# Altium schematic sheet Micromouse_Version2.SchDoc
size A3
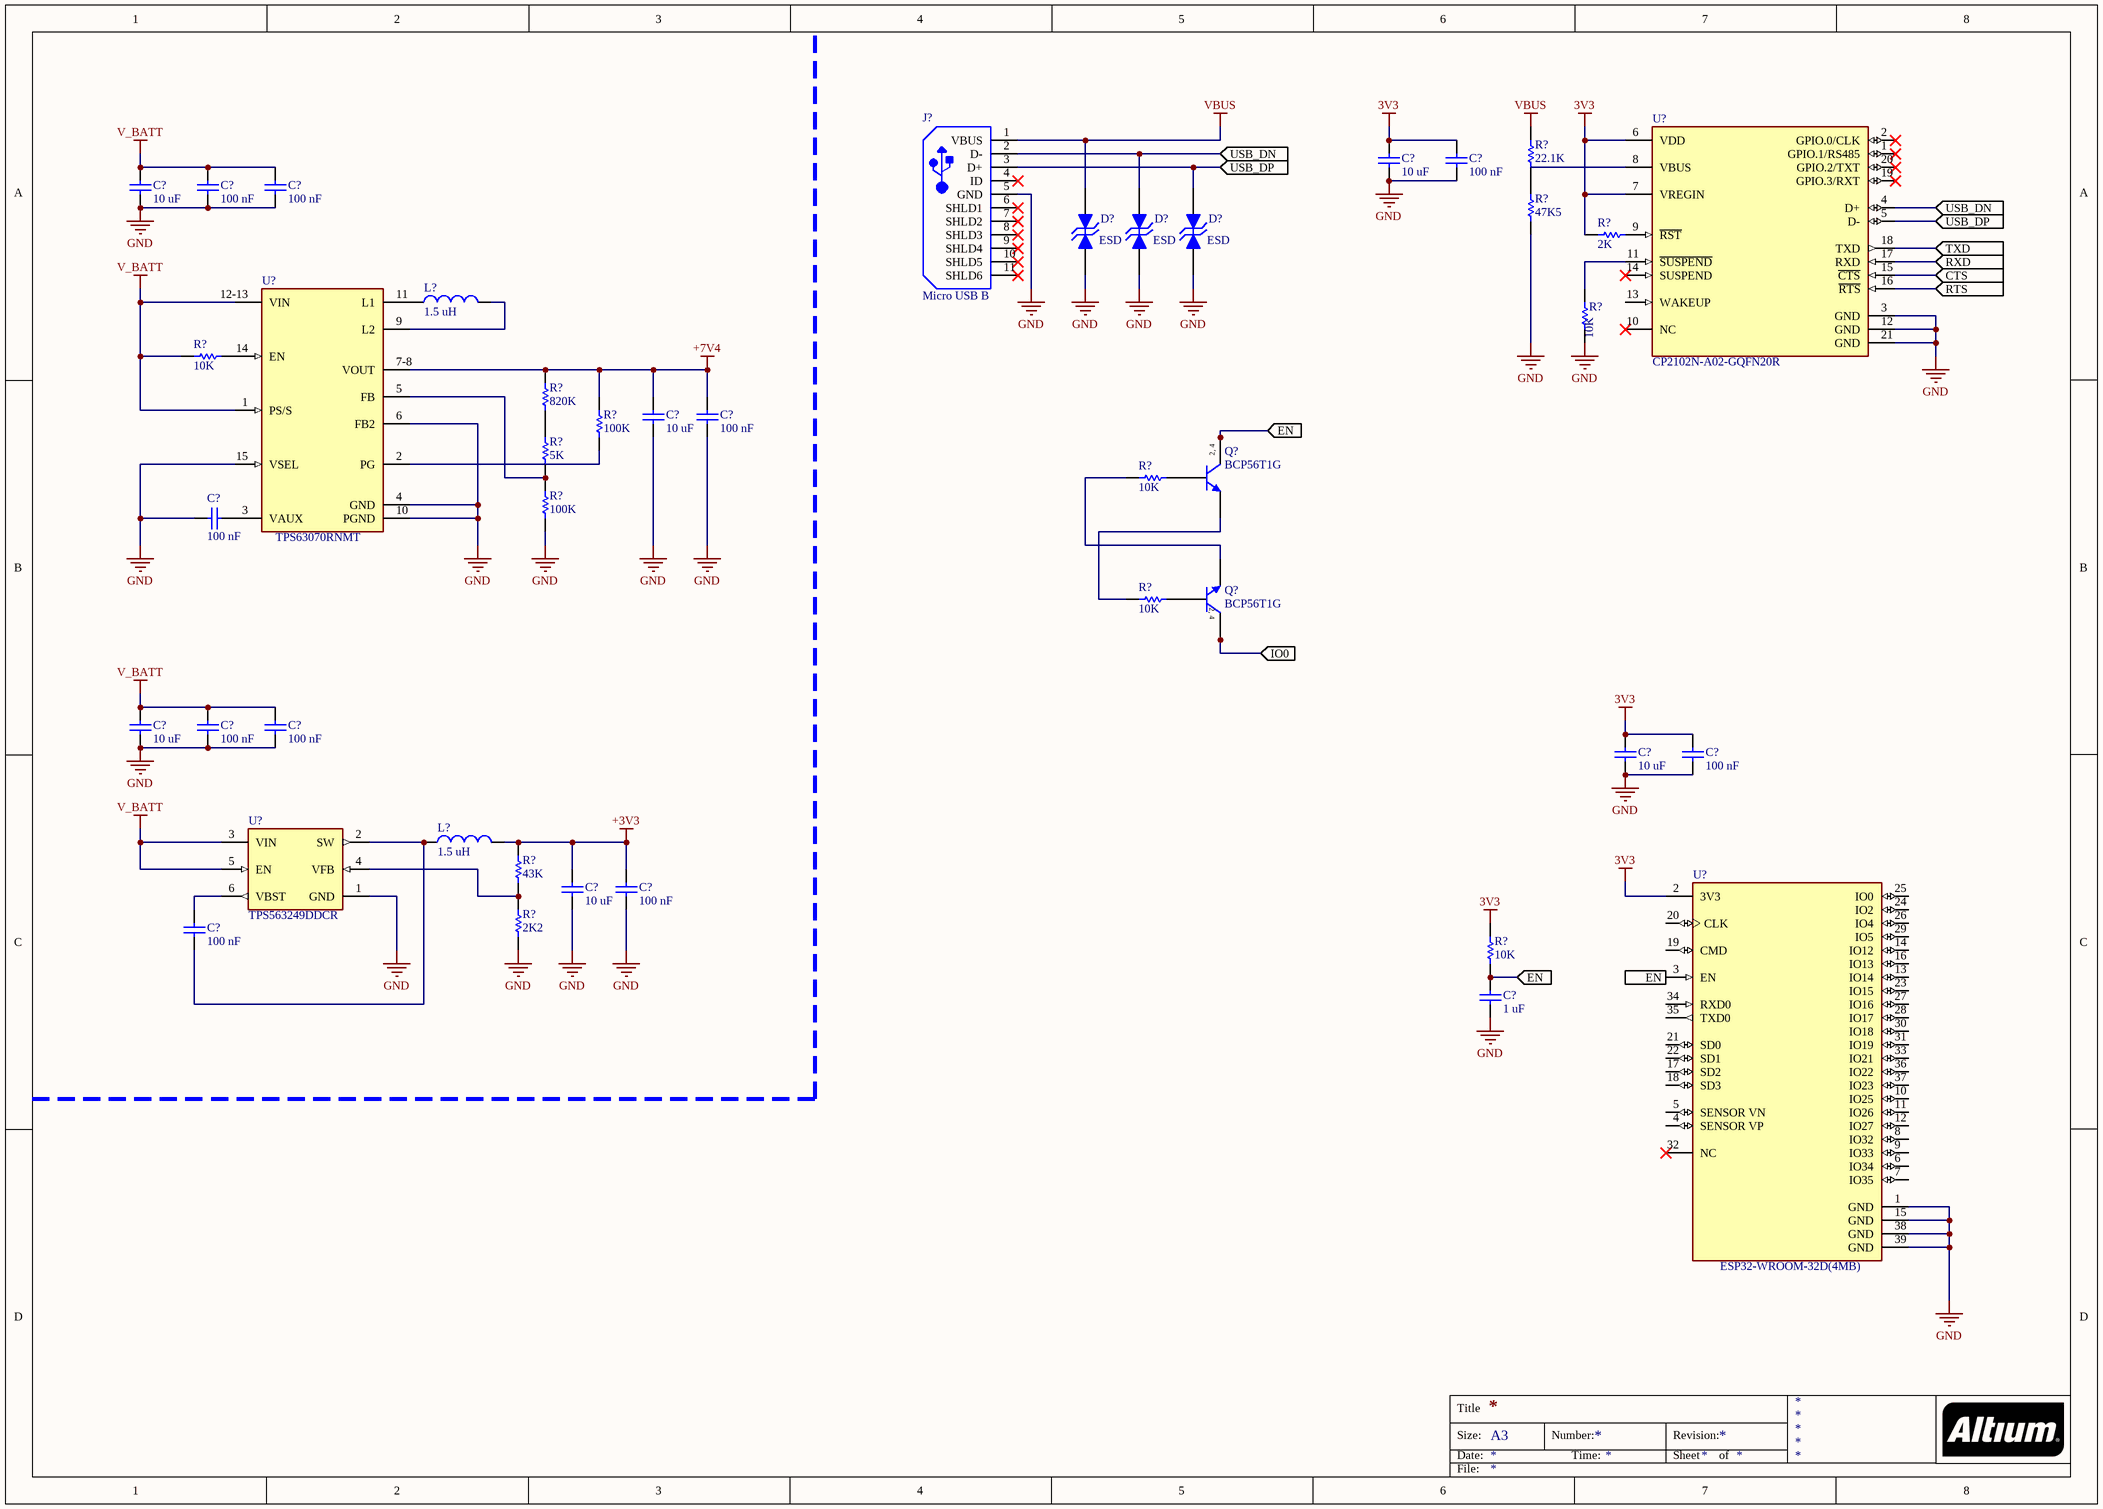
[diagram p0: Micromouse_Version2.SchDoc]

## Parts
(Parts that share a designator on the sheet are numbered #1, #2 ... from top to bottom, then left to right.)
C?#1  10 uF  [CAPC3216X180X50LL20T25]
C?#2  100 nF  [CAPC3216X180X55LL20T25]
C?#3  10 uF  [CAPC3216X180X50LL20T25]
C?#4  100 nF  [CAPC3216X180X55LL20T25]
C?#5  100 nF  [CAPC3216X180X55LL20T25]
C?#6  10 uF  [CAPC3216X180X50LL20T25]
C?#7  100 nF  [CAPC3216X180X55LL20T25]
C?#8  100 nF  [CAPC3216X180X55LL20T25]
C?#9  10 uF  [CAPC3216X180X50LL20T25]
C?#10  100 nF  [CAPC3216X180X55LL20T25]
C?#11  100 nF  [CAPC3216X180X55LL20T25]
C?#12  10 uF  [CAPC3216X180X50LL20T25]
C?#13  100 nF  [CAPC3216X180X55LL20T25]
C?#14  10 uF  [CAPC3216X180X50LL20T25]
C?#15  100 nF  [CAPC3216X180X55LL20T25]
C?#16  100 nF  [CAPC3216X180X55LL20T25]
C?#17  1 uF  [CAPC3216X180X50ML20T25]
D?#1  ESD  [ONSC-SOD-923-2-514AB-01_V]
D?#2  ESD  [ONSC-SOD-923-2-514AB-01_V]
D?#3  ESD  [ONSC-SOD-923-2-514AB-01_V]
J?  Micro USB B  [FCI-10118192-0001LF-5_V]
L?#1  1.5 uH  [VISH-IHLP2525CZER1R5M01_V]
L?#2  1.5 uH  [VISH-IHLP2525CZER1R5M01_V]
Q?#1  BCP56T1G  [ONSC-SOT-223-4-318E-04_V]
Q?#2  BCP56T1G  [ONSC-SOT-223-4-318E-04_V]
R?#1  22.1K  [RESC3216X70X50NL05T20]
R?#2  47K5  [RESC1206(3216)_L]
R?#3  2K  [RESC3216X70X50ML20T25]
R?#4  10K  [RESC3216X60X45ML10T20]
R?#5  10K  [RESC3216X60X45ML10T20]
R?#6  820K  [RESC3216X70X50LL20T25]
R?#7  100K  [RESC3216X60X45NL10T20]
R?#8  5K  [RESC3216X84X51LL20T13]
R?#9  10K  [RESC3216X60X45ML10T20]
R?#10  100K  [RESC3216X60X45NL10T20]
R?#11  10K  [RESC3216X60X45ML10T20]
R?#12  43K  [RESC3216X70X50NL05T20]
R?#13  2K2  [RESC3216X60X45NL10T20]
R?#14  10K  [RESC3216X60X45ML10T20]
U?#1  CP2102N-A02-GQFN20R  [FP-CP2102N-A02-GQFN20R-MFG]
U?#2  TPS63070RNMT  [FP-RNM0015A-MFG]
U?#3  TPS563249DDCR  [FP-DDC0005A-MFG]
U?#4  ESP32-WROOM-32D(4MB)  [FP-ESP32-WROOM-32D_4MB-MFG]

## Ports
CTS (in), EN (in), IO0 (in), RTS (in), RXD (in), TXD (in), USB_DN (in), USB_DP (in)

## Nets
3V3: C?#1.2 C?#2.2 C?#12.2 C?#13.2 R?#3.1 R?#14.2 U?#1.6(VDD) U?#1.7(VREGIN) U?#4.2(3V3)
+3V3: C?#14.2 C?#15.2 L?#2.2 R?#12.2
+7V4: C?#6.2 C?#7.2 R?#6.2 R?#7.2 U?#2.7-8(VOUT)
GND: C?#1.1 C?#2.1 C?#3.1 C?#4.1 C?#5.1 C?#6.1 C?#7.1 C?#8.1 C?#9.1 C?#10.1 C?#11.1 C?#12.1 C?#13.1 C?#14.1 C?#15.1 C?#17.1 D?#1.1(A1) D?#2.1(A1) D?#3.1(A1) J?.5(GND) R?#2.1 R?#4.1 R?#10.1 R?#13.1 U?#1.3(GND) U?#1.12(GND) U?#1.21(GND) U?#2.4(GND) U?#2.6(FB2) U?#2.10(PGND) U?#2.15(VSEL) U?#3.1(GND) U?#4.1(GND) U?#4.15(GND) U?#4.38(GND) U?#4.39(GND)
V_BATT: C?#3.2 C?#4.2 C?#5.2 C?#9.2 C?#10.2 C?#11.2 R?#5.1 U?#2.1(PS/S) U?#2.12-13(VIN) U?#3.3(VIN) U?#3.5(EN)
VBUS: D?#1.2(A2) J?.1(VBUS) R?#1.2
CTS: U?#1.15(~{CTS}) ; port CTS
EN: C?#17.2 Q?#1.2(C) Q?#1.4(C) R?#14.1 U?#4.3(EN) ; port EN
IO0: Q?#2.2(C) Q?#2.4(C) ; port IO0
RTS: U?#1.16(~{RTS}) ; port RTS
RXD: U?#1.17(RXD) ; port RXD
TXD: U?#1.18(TXD) ; port TXD
USB_DN: D?#2.2(A2) J?.2(D-) U?#1.4(D+) ; port USB_DN
USB_DP: D?#3.2(A2) J?.3(D+) U?#1.5(D-) ; port USB_DP
NetC?#8_2: C?#8.2 U?#2.3(VAUX)
NetC?#16_1: C?#16.1 L?#2.1 U?#3.2(SW)
NetC?#16_2: C?#16.2 U?#3.6(VBST)
NetL?#1_1: L?#1.1 U?#2.11(L1)
NetL?#1_2: L?#1.2 U?#2.9(L2)
NetQ?#1_1: Q?#1.1(B) R?#9.1
NetQ?#1_3: Q?#1.3(E) R?#11.2
NetQ?#2_1: Q?#2.1(B) R?#11.1
NetQ?#2_3: Q?#2.3(E) R?#9.2
NetR?#1_1: R?#1.1 R?#2.2
NetR?#4_2: R?#4.2 U?#1.11(~{SUSPEND})
NetR?#5_2: R?#5.2 U?#2.14(EN)
NetR?#6_1: R?#6.1 R?#8.2
NetR?#7_1: R?#7.1 U?#2.2(PG)
NetR?#8_1: R?#8.1 R?#10.2 U?#2.5(FB)
NetR?#12_1: R?#12.1 R?#13.2 U?#3.4(VFB)

Not connected (* = marked no-connect by the designer): J? 4(ID)* 6(SHLD1)* 7(SHLD2)* 8(SHLD3)* 9(SHLD4)* 10(SHLD5)* 11(SHLD6)*; R?#3 2; U?#1 1(GPIO.1/RS485)* 2(GPIO.0/CLK)* 8(VBUS) 9(~{RST}) 10(NC)* 13(WAKEUP) 14(SUSPEND)* 19(GPIO.3/RXT)* 20(GPIO.2/TXT)*; U?#4 4(SENSOR_VP) 5(SENSOR_VN) 6(IO34) 7(IO35) 8(IO32) 9(IO33) 10(IO25) 11(IO26) 12(IO27) 13(IO14) 14(IO12) 16(IO13) 17(SD2) 18(SD3) 19(CMD) 20(CLK) 21(SD0) 22(SD1) 23(IO15) 24(IO2) 25(IO0) 26(IO4) 27(IO16) 28(IO17) 29(IO5) 30(IO18) 31(IO19) 32(NC)* 33(IO21) 34(RXD0) 35(TXD0) 36(IO22) 37(IO23)

## Notes on the sheet
- Title
- Size:
- Date:
- A3
- Number:
- Time:
- Revision:
- Sheet
- of
- File:
- (in symbol CMP-1048-00523-1) 2, 4

## Library data of the parts
C?#1 C?#3 C?#6 C?#9 C?#12 C?#14 = CMP-2000-06013-1: Chip Capacitor, 10 uF, +/- 10%, 10 V, -55 to 125 degC, 1206 (3216 Metric), RoHS, Tape and Reel; Type: SMDMLCCX7R6.3-250VDCCommericalGrade; Class: Class1; Case Height: 1.6mm; Temperature Coefficient / Code: +/-15%; Capacitance: 10uF; Brand: Kemet; Case Length: 3.2mm; Dissipation Factor DF: 5; Voltage Rating: 10V; Dielectric: X7R; Tolerance: 10%; Package Reference: 1206; Dimensions: 1.6mmWx3.2mmLx1.6mmH; Series: C1206C; Minimum Operating Temperature: -55C; RoHS: Details; Termination Style: SMD/SMT; Mounting Technology: SurfaceMount; Manufacturer: Kemet; Product Category: MultilayerCeramicCapacitorsMLCC-SMD/SMT; Case Code - mm: 3216; Manufacturer URL: http://www.kemet.com/; Product: GeneralTypeMLCCs; Package Description: 2-Pin Surface Mount Device, Body 3.2 x 1.6 mm; Case Width: 1.6mm; Factory Pack Quantity: 2000; Package / Case: 1206(3216metric); Datasheet URL: http://www.kemet.com/docfinder?Partnumber=C1206C106K8RACTU; Datasheet Version: 02/2016; Operating Temperature Range: -55Cto+125C; Voltage Rating DC: 10V; Case Code - in: 1206; Maximum Operating Temperature: +125C; Packaging: Reel
C?#2 C?#4 C?#5 C?#7 C?#8 C?#10 C?#11 C?#13 C?#15 C?#16 = CMP-2000-06343-1: Chip Capacitor, 100 nF, +/- 5%, 25 V, -55 to 125 degC, 1206 (3216 Metric), RoHS, Tape and Reel; Manufacturer: Murata; External Width: 0.5mm; Voltage Rating V DC: 25V; Capacitor Case Style: 1206[3216Metric]; Insulation Resistance: 10000Mohm; Capacitor Terminals: SMD; Capacitance: 0.1µF; Temperature Coefficient: 0ppm/°C±30ppm/°C; External Length / Height: 1mm; Reel Quantity: 2000; Dielectric Characteristic: C0G/NP0; SVHC: NoSVHC(19-Dec-2012); No. of Pins: 2; Manufacturer URL: http://www.murata.com/; Mounting Technology: SurfaceMount; Operating Temperature Range: -55°Cto+125°C; Operating Temperature Max: 125°C; Package Description: 2-Pin Surface Mount Device, Body 3.2 x 1.6 mm; Operating Temperature Min: -55°C; Terminal Type: SurfaceMount(SMD,SMT); MSL: –; Tolerance +: 5%; Voltage Rating: 25V; Datasheet URL: https://datasheet.ciiva.com/3777/11308grm31c5c1e104ja0123-3777177.pdf; Datasheet Version: 09/2014; Package / Case: 1206; Capacitance Tolerance: ±5%; Package Reference: 1206; Lead Spacing: –; Tolerance -: 5%
C?#17 = CMP-2000-04991-1: Chip Capacitor, 1 uF, +/- 10%, 25 V, -55 to 125 degC, 1206 (3216 Metric), RoHS, Tape and Reel; Manufacturer: Kemet; Temperature Coefficient / Code: +/-15%; Capacitance: 1uF; Dielectric: X7R; Voltage Rating DC: 25V; Capacitance - nF: 1000nF; Class: Class1; Case Length: 3.2mm; Type: SMDMLCCX7R6.3-250VDCCommericalGrade; Case Width: 1.6mm; Product: GeneralTypeMLCCs; Datasheet URL: https://ciiva.com/datasheet-click-18194173?src=ciiva&sig=6daff8c4; Operating Temperature Range: -55Cto+125C; Series: C1206C; RoHS: Details; Product Category: MultilayerCeramicCapacitorsMLCC-SMD/SMT; Manufacturer URL: http://www.kemet.com/; Minimum Operating Temperature: -55C; Dimensions: 1.6mmWx3.2mmLx1.6mmH; Termination Style: SMD/SMT; Brand: Kemet; Packaging: Reel; Package / Case: 1206(3216metric); Case Code - mm: 3216; Datasheet Version: Jul-14; Factory Pack Quantity: 2000; Package Description: 2-Pin Surface Mount Device, Body 3.2 x 1.6 mm; Tolerance: 10%; Package Reference: 1206; Case Height: 1.6mm; Case Code - in: 1206; Maximum Operating Temperature: +125C; Voltage Rating: 25V
D?#1-D?#3 = CMP-1063-00118-1: ON SEMICONDUCTOR - ESD7951ST5G - ESD Protection Device, 12.9 V, SOD-923, 2 Pins, 5 V, 150 mW, ESD79 Series; Clamping Voltage: 12.9V; Reverse Standoff Voltage: 5V; Min Breakdown Voltage: 5.4V; Power Line Protection: No; Peak Pulse Current: 1A; Capacitance: 0.9pF; Direction: Bidirectional; Number of Bidirectional Channels: 1; Leakage Current: 1uA; Peak Pulse Power: 150mW; Test Current: 1mA; ESD Protection: Yes; Element Configuration: Single; Supplier 1: Digi-Key; Supplier Part Number 1: ESD7951ST5GOSCT-ND; Manufacturer: ON Semiconductor; Manufacturer Part Number: ESD7951ST5G; RoHS: Yes; Category: ESD and Circuit Protection ICs; Stock 1: 4793; Pricing 1: 1=0.40000, 10=0.29500, 100=0.14020, 500=0.11440, 1000=0.08487, 2000=0.07454 (USD); Case/Package: SOD-923-2; Number of Pins: 2; Contact Plating: Tin,Matte; Min Operating Temperature: -55°C; Max Operating Temperature: 125°C; Packaging: Tape and Reel; Resistor Type: Zener; Polarity: Bidirectional; Breakdown Voltage: 5.4V; Number of Channels: 1; Termination: SMD/SMT; Working Voltage: 5V; Package Quantity: 1; Operating Supply Voltage: 5V; Max Power Dissipation: 150mW; Max Reverse Leakage Current: 1uA; Number of Lines: 1; Length: 0.8mm; Width: 0.65mm; Height: 0.4mm; Depth: 0.6mm; Radiation Hardening: No; Lead Free: Lead Free; REACH SVHC: No SVHC; Halogen Free: Halogen Free; ComponentLink1URL: https://datasheet.ciiva.com/6577/esd7951s-d-6577856.pdf?src-supplier=Digi-Key; ComponentLink1Description: https://datasheet.ciiva.com/6577/esd7951s-d-6577856.pdf?src-supplier=Digi-Key; ComponentLink2URL: https://datasheet.ciiva.com/6577/esd7951s-d-6577856.pdf?src-supplier=Avnet; ComponentLink2Description: https://datasheet.ciiva.com/6577/esd7951s-d-6577856.pdf?src-supplier=Avnet; ComponentLink3URL: https://datasheet.ciiva.com/30479/0900766b81250942-30479090.pdf?src-supplier=RSComponents; ComponentLink3Description: https://datasheet.ciiva.com/30479/0900766b81250942-30479090.pdf?src-supplier=RSComponents; ComponentLink4URL: https://datasheet.ciiva.com/4479/esd7951s-d-92833-4479383.pdf?src-supplier=Mouser; ComponentLink4Description: https://datasheet.ciiva.com/4479/esd7951s-d-92833-4479383.pdf?src-supplier=Mouser; ComponentLink5URL: https://datasheet.ciiva.com/28375/esd7951s-d-28375391.pdf?src-supplier=Avnet+Europe; ComponentLink5Description: https://datasheet.ciiva.com/28375/esd7951s-d-28375391.pdf?src-supplier=Avnet+Europe; ComponentLink6URL: https://datasheet.ciiva.com/11195/esd7951s-d-11195307.pdf?src-supplier=Avnet; ComponentLink6Description: https://datasheet.ciiva.com/11195/esd7951s-d-11195307.pdf?src-supplier=Avnet; ComponentLink7URL: https://datasheet.ciiva.com/6577/esd7951s-d-6577852.pdf?src-supplier=Digi-Key; ComponentLink7Description: https://datasheet.ciiva.com/6577/esd7951s-d-6577852.pdf?src-supplier=Digi-Key; ComponentLink8URL: https://datasheet.ciiva.com/6577/esd7951s-d-6577854.pdf?src-supplier=Digi-Key; ComponentLink8Description: https://datasheet.ciiva.com/6577/esd7951s-d-6577854.pdf?src-supplier=Digi-Key
J? = CMP-2000-05118-1: Micro USB B Type Receptacle, -55 to 85 degC, 5-Pin SMD, RoHS, Tape and Reel; Manufacturer: FCI; Current Rating: 1.8A; Number of Contacts: 5Contact; Mounting Angle: Right; Insulation Resistance: 1000MOhms; Connector Type: MicroUSBTypeBreceptacle; Gender: Female; Packaging: Reel; Termination Style: SMD/SMT; Product Category: USBConnectors; RoHS: Details; Flammability Rating: UL94V-0; Standard: USB2.0; Brand: FCI; Manufacturer URL: http://www.fci.com/; Product: MicroUSBTypeBConnectors; Operating Temperature Range: -55Cto+85C; Datasheet Version: Rev. B, 05/2015; Contact Material: CopperAlloy; Contact Plating: Gold; Datasheet URL: http://www.mouser.com/ds/2/154/10118192-793027.pdf; Color: Black; Factory Pack Quantity: 1400
L?#1 L?#2 = CMP-2000-06441-1: Low-Profile, High-Current IHLP(R) Inductor, 1.5 uH, +/- 20%, 9 A, -55 to 125 degC, 2-Pin SMD, RoHS, Tape and Reel; Manufacturer: Vishay; DC Resistance (DCR): 15mOhmMax; Current Rating: 9A; Shielding: Shielded; Featured Product: IHLP®Surface-MountPowerInductors; Product Training Modules: IHLPInductorSeries; Catalog Drawings: IHLP2525CZERSeriesSideIHLP2525CZERSeriesTop; Type: Molded; Frequency - Test: 100kHz; Inductance: 1.5µH; Online Catalog: IHLP®Series; Other Names: 541-1007-6; Current - Saturation: 18A; EDA / CAD Models: DownloadfromAcceleratedDesigns; Package / Case: Nonstandard; Standard Package: 1; Tolerance: ±20%; Series: IHLP-2525CZ-01; Datasheet Version: 09/2016; Datasheet URL: http://www.vishay.com/docs/34104/lp25cz01.pdf; Family: FixedInductors; Packaging: Digi-Reel®; Category: Inductors,Coils,Chokes; Size / Dimension: 0.270"Lx0.255"W(6.86mmx6.47mm); Manufacturer URL: http://www.vishay.com/; Package Reference: IHLP2525CZER1R5M01; Package Description: 2-Pin Surface Mount Device, Body 6.47 x 6.47 mm; Mounting Technology: SurfaceMount; Operating Temperature: -55°C~125°C; Height - Seated (Max): 0.118"(3.00mm); Mounting Type: SurfaceMount
Q?#1 Q?#2 = CMP-1048-00523-1: NPN Silicon Epitaxial Transistor, 4-Pin SOT-223, Pb-Free, Tape and Reel; Manufacturer: On Semiconductor; IC Continuous (A): 1; ComponentLink1Description: Manufacturer URL; ComponentLink3Description: Package Specification; PackageVersion: Rev. N, 08/2009; ComponentLink1URL: http://www.onsemi.com/; ComponentLink2URL: http://www.onsemi.com/pub_link/Collateral/BCP56T1-D.PDF; Polarity: NPN; PartNumber: BCP56T1G; ComponentLink3URL: http://www.onsemi.com/pub_link/Collateral/318E-04.PDF; Mounting Technology: Surface Mount; RoHS: TRUE; DatasheetVersion: Rev. 8; Packing: Tape and Reel; PackageReference: SOT-223-4-318E-04; ComponentLink2Description: Datasheet; PackageDescription: 4-Pin Small Outline Transistor, Body 6.5 x 3.5 mm, Pitch 2.3 mm
R?#1 = CMP-2003-00221-1: Part Number: ERJ-8ENF2212V; Manufacturer: Panasonic
R?#2 = CMP-1014-00700-1: 47K5 0.25W 1% 1206 (3216 Metric)  SMD; Case-EIA: 1206; Case-Metric: 3216; Value: 47500.00 Ohm; Tolerance: 1 %; Power: 0.25 W; Technology: SMT
R?#3 = CMP-2003-04435-1: Part Number: ERA8AEB202V; Manufacturer: Panasonic
R?#4 R?#5 R?#9 R?#11 R?#14 = CMP-2003-04808-1: Manufacturer: Vishay Dale; Part Number: CRCW120610K0JNEA
R?#6 = CMP-2003-00010-1: Manufacturer: Panasonic; Part Number: ERA8AEB824V
R?#7 R?#10 = CMP-2003-04798-1: Part Number: CRCW1206100KFKEA; Manufacturer: Vishay Dale
R?#8 = CMP-2003-04380-1: Part Number: PNM1206E5001BST5; Manufacturer: Vishay Dale
R?#12 = CMP-2003-00847-1: Manufacturer: Panasonic; Part Number: ERJ8ENF4302V
R?#13 = CMP-2003-02034-1: Manufacturer: Vishay Dale; Part Number: CRCW12062K20FKEA
U?#1 = CMP-08107-000007-1: IC USB TO UART BRIDGE QFN20
U?#2 = CMP-04918-000001-1: IC REG BCK BST ADJ 2A 15VQFN; Manufacturer: Texas Instruments; Number Of Outputs: 1; Max Duty Cycle: 100%; Output Type: AdjustableProgrammable; Max Supply Voltage: 16V; Max Junction Temp: +125°C; Switching Topology: Buck-Boost; Output Voltage: 2.5-9V; Standoff Height: 0mm; Min Supply Voltage: 2V; Switching Frequency: 2400kHz; Nominal Supply Current: 5-54uA; Temperature: -40°C to +125°C; Manufacturer Part Number: TPS63070RNMT; Device Class L1: Integrated Circuits (ICs); RoHS: TRUE; Package: RNM0015A; Octopart: https://octopart.com/tps63070rnmt-texas+instruments-75117739; Output Current: 2A; Device Class L3: Voltage Regulators - Switching; Temperature Range High: +125°C; ComponentLink2Description: Datasheet; ComponentLink2URL: http://www.ti.com/lit/ds/symlink/tps63070.pdf; Lead Free: Yes; Device Class L2: Power Management ICs; Automotive: No; Height: 1mm; Temperature Range Low: -40°C; Category: IC; Digikey Description: IC REG BCK BST ADJ 2A 15VQFN
U?#3 = CMP-04918-000108-1: 17-V, 3-A, CONSTANT 1.4-MHZ SYNC; Manufacturer: Texas Instruments; Min Supply Voltage: 4.5V; Output Voltage: 0.6-7V; Output Current: 3A; Max Junction Temp: +125°C; Switching Frequency: 1.4MHz; Output Type: AdjustableProgrammable; Standoff Height: 0mm; Switching Topology: Buck; Number Of Outputs: 1; Max Supply Voltage: 17V; Ipc Land Pattern Name: SOT95P280X110-6; RoHS: TRUE; Footprint Url: http://www.ti.com/lit/ds/symlink/tlv700.pdf; Temperature Range Low: -40°C; Device Class L2: Power Management ICs; Category: IC; Device Class L1: Integrated Circuits (ICs); Manufacturer Part Number: TPS563249DDCR; Device Class L3: Voltage Regulators - Switching; Octopart: https://octopart.com/tps563249ddcr-texas+instruments-97650651; Temperature Range High: +125°C; Height: 1.1mm; Lead Free: Yes; ComponentLink2Description: Datasheet; ComponentLink2URL: http://www.ti.com/lit/ds/symlink/tps563249.pdf; Package: DDC0005A; Automotive: No; Digikey Description: 17-V, 3-A, CONSTANT 1.4-MHZ SYNC; Temperature: -40°C to +125°C
U?#4 = ESP32-WROOM-32D(4MB): Bluetooth and Wi-Fi Module 2.4GHz to 2.5GHz 2.7V to 3.6V 4MB Flash 38-Pin SMD Module; Manufacturer: Espressif Systems; Supplier 1: Digi-Key; Supplier Part Number 1: 1965-ESP32-WROOM-32D(4MB)CT-ND; Manufacturer Part Number: ESP32-WROOM-32D(4MB); RoHS: No; Stock 1: 8156; Pricing 1: 1=3.800000 (USD)